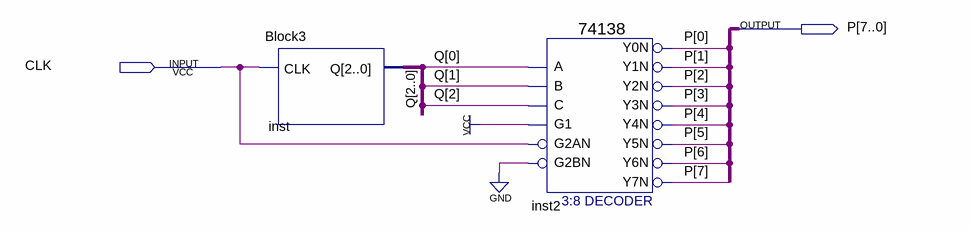
[diagram p0: schematic sheet]
// Quartus schematic frio.bdf as structural Verilog: 2 symbols, 2 pins
module frio (
  input  CLK,
  output [7:0] P
);

  wire [2:0] Q;

  Block3 inst (.CLK(CLK), .Q(Q));
  \74138  inst2 (
    .A(Q[0]), .B(Q[1]), .G1(1'b1), .C(Q[2]), .G2AN(CLK), .G2BN(1'b0), .Y0N(P[0]), .Y1N(P[1]), .Y2N(P[2]),
    .Y3N(P[3]), .Y4N(P[4]), .Y5N(P[5]), .Y6N(P[6]), .Y7N(P[7]));
endmodule
